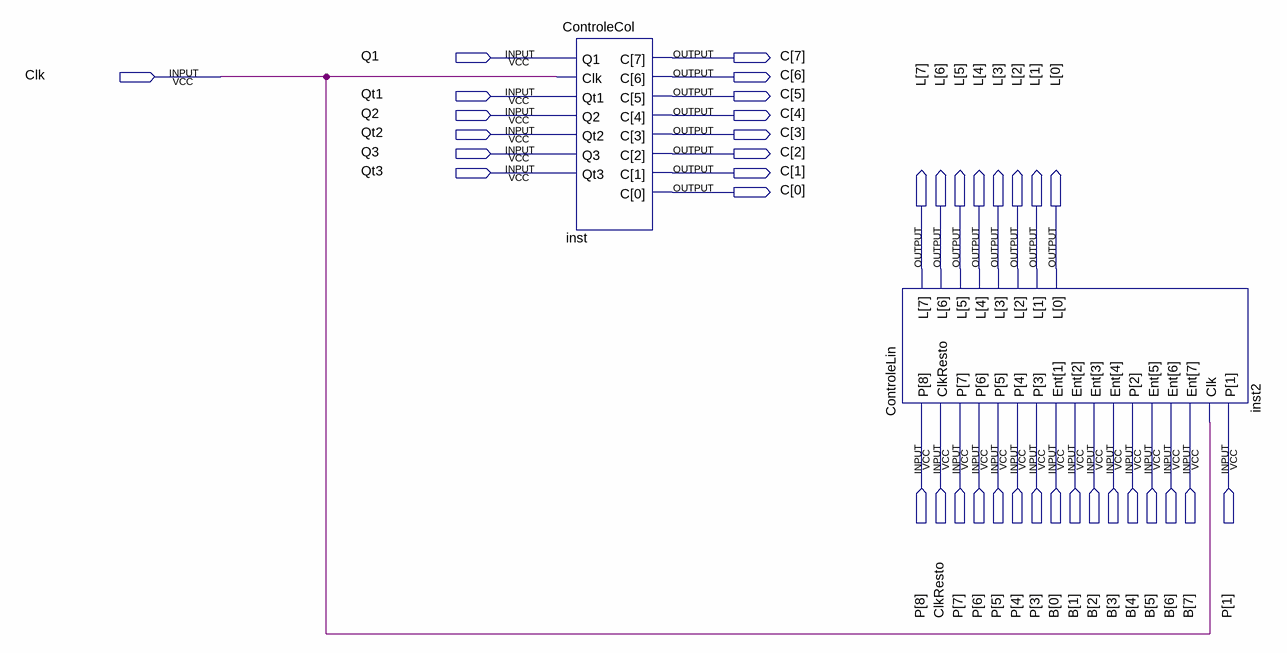
[diagram p0: schematic sheet]
// Quartus schematic ControleMatriz.bdf as structural Verilog: 2 symbols, 39 pins
module ControleMatriz (
  input  Q1,
  input  Clk,
  input  Qt1,
  input  Q2,
  input  Qt2,
  input  Q3,
  input  Qt3,
  input  [8:1] P,
  input  ClkResto,
  input  [7:0] B,
  output [7:0] C,
  output [7:0] L
);

  ControleCol inst (.Q1(Q1), .Clk(Clk), .Qt1(Qt1), .Q2(Q2), .Qt2(Qt2), .Q3(Q3), .Qt3(Qt3), .C(C));
  ControleLin inst2 (.P({P[8:3], B[4], P[1]}), .ClkResto(ClkResto), .Ent({B[7:5], B[3:0]}), .Clk(Clk), .L(L));
endmodule
